# Altium project DRVS-MOTOR.PrjPcb
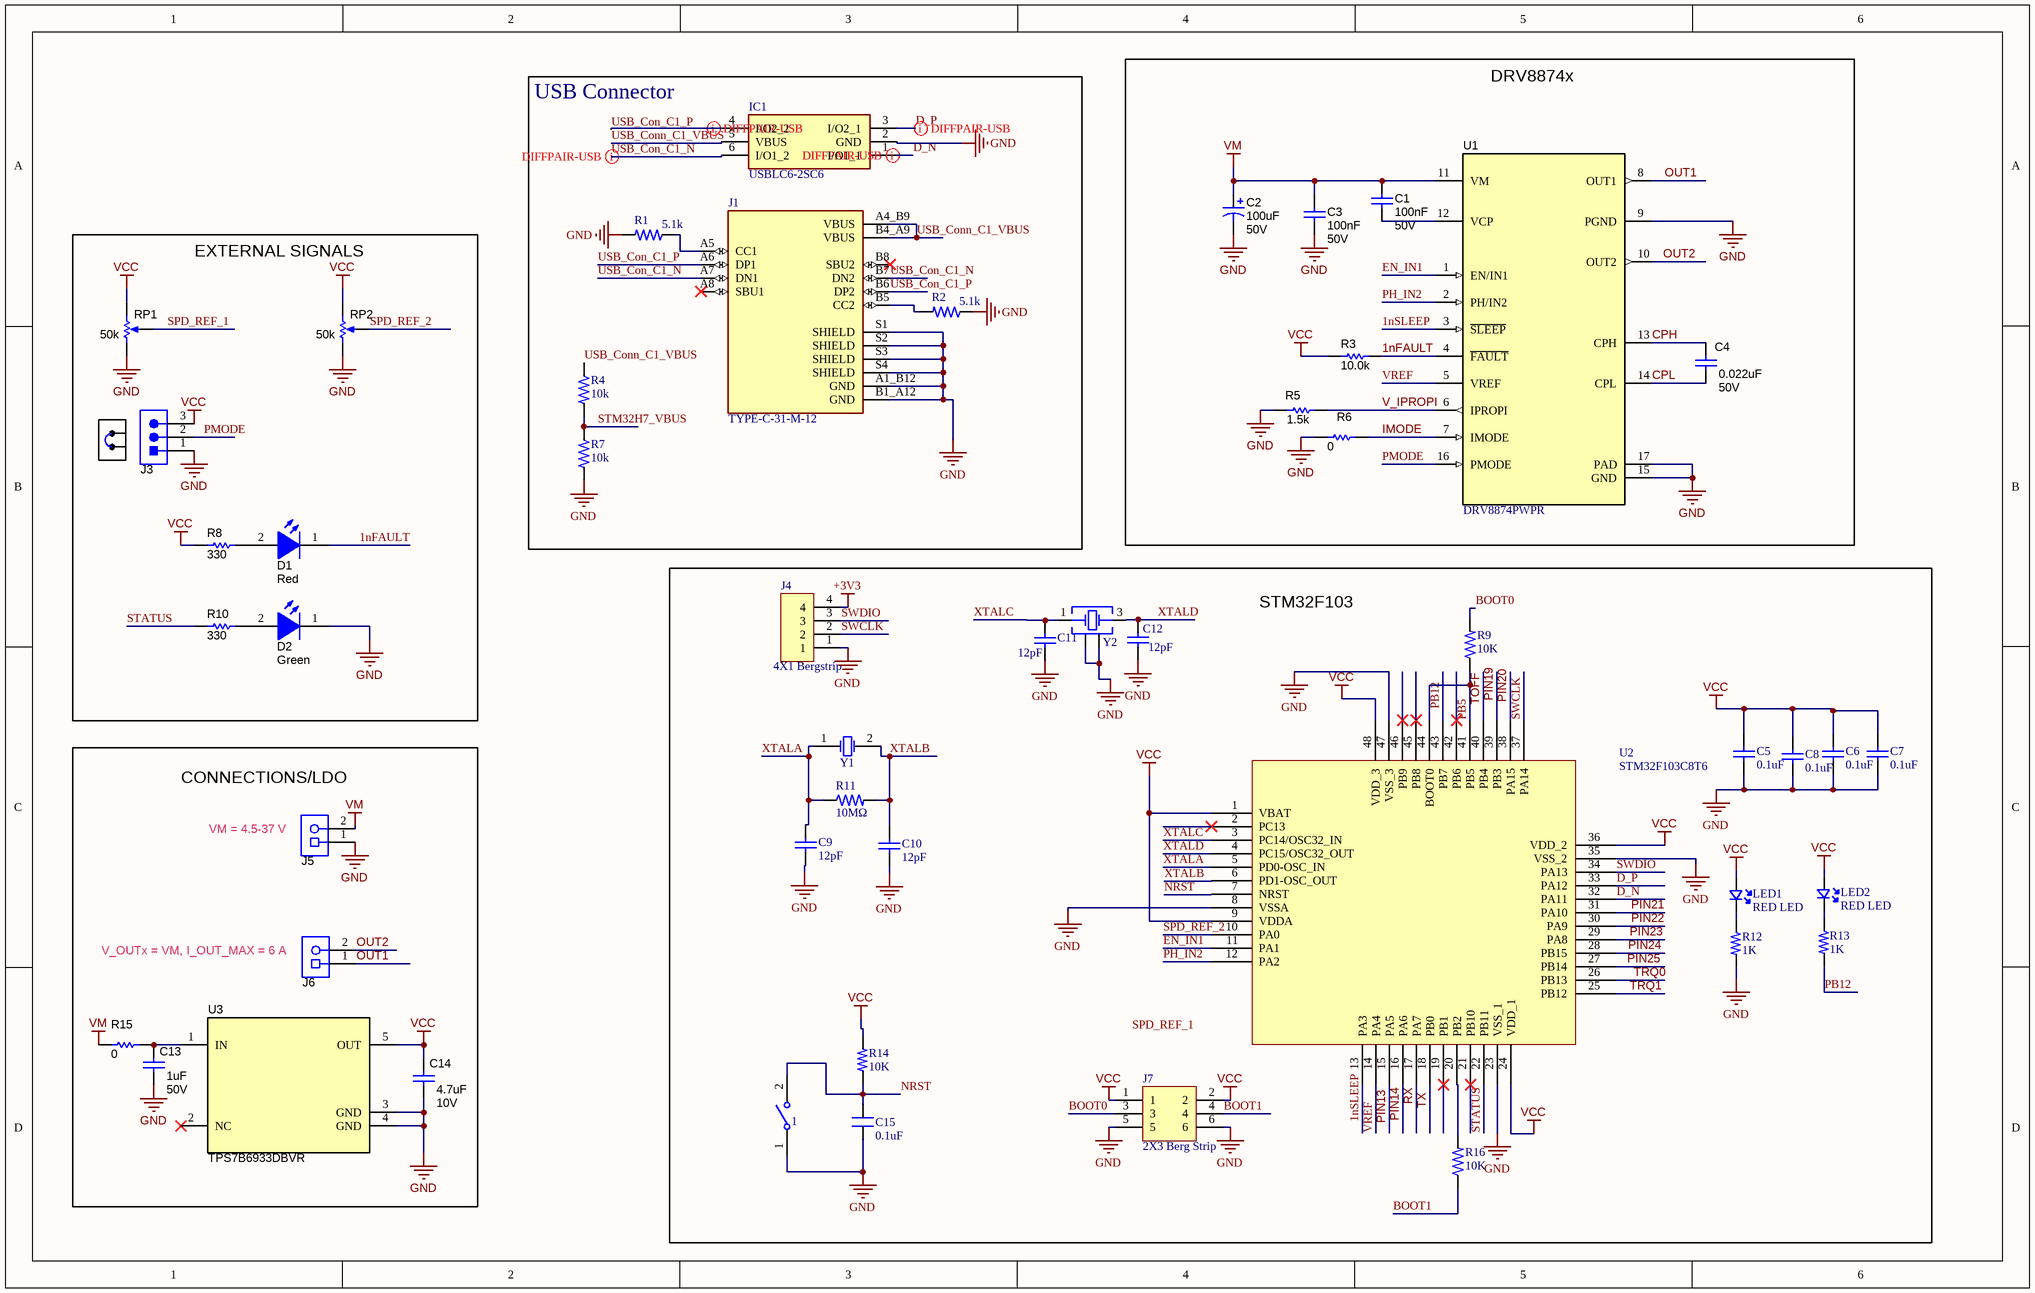
[diagram p0: DRVS-SCHEMA.SchDoc]
3 sheets, 72 parts. Net scope: global (net labels, ports and power ports of the same name join across sheets).
Board file: DRVS-PCB.PcbDoc
Sheets:
  DRVS-SCHEMA.SchDoc
  usb sheet.SchDoc
  stepper-schematic.SchDoc

## Sheet DRVS-SCHEMA.SchDoc
size 381 x 241 mm; SheetNumber: 1; SheetTotal: 3

### Parts
1  434113025826  [WS-TASV_L6W3.8H2.5_4341x30258x6]  (value not drawn)
C1  Cap_F: 100nF  VDC_V: 50V  [0603L]  (hidden comment: 885012206095)
C2  ValueDisplayed: 100uF  VDC_V: 50V  [BT_1000x1250]  (hidden comment: UBT1H101MPD1TD)
C3  Cap_F: 100nF  VDC_V: 50V  [0603L]  (hidden comment: 885012206095)
C4  ValueDisplayed: 0.022uF  VDC_V: 50V  [0603L]  (hidden comment: 885012206091)
C5  0.1uF  [WCAP-CSST_0603_L1.6W0.8H0.8_Reflow]
C6  0.1uF  [WCAP-CSST_0603_L1.6W0.8H0.8_Reflow]
C7  0.1uF  [WCAP-CSST_0603_L1.6W0.8H0.8_Reflow]
C8  0.1uF  [WCAP-CSST_0603_L1.6W0.8H0.8_Reflow]
C9  12pF  [WCAP-CSST_0603_L1.6W0.8H0.8_Reflow]
C10  12pF  [WCAP-CSST_0603_L1.6W0.8H0.8_Reflow]
C11  12pF  [WCAP-CSST_0603_L1.6W0.8H0.8_Reflow]
C12  12pF  [WCAP-CSST_0603_L1.6W0.8H0.8_Reflow]
C13  ValueDisplayed: 1uF  VDC_V: 50V  [0805L]  (hidden comment: 885012207103)
C14  ValueDisplayed: 4.7uF  VDC_V: 10V  [0603L]  (hidden comment: C0603C475K8PACTU)
C15  0.1uF  [CAP_0805]
D1  value Red  [WL-SMCW_RED]  (hidden comment: 150060RS75000)
D2  value Green  [WL-SMCW_GREEN]  (hidden comment: 150060VS75000)
IC1  USBLC6-2SC6  [SOT95P280X145-6N]
J1  TYPE-C-31-M-12  [HRO_TYPE-C-31-M-12]
J3  61300311121  [WURTH_61300311121]  (value not drawn)
J4  4X1 Bergstrip  [CON4_100_40D72_TH_ST_MALE]
J5  CMP-0054828-1  [Wurth_691101710002]  (value not drawn)
J6  CMP-0054828-1  [Wurth_691101710002]  (value not drawn)
J7  2X3 Berg Strip  [CON6_100_59D78_TH_ST_Duplicate]
LED1  RED LED  [LED_0805]
LED2  RED LED  [LED_0805]
R1  5.1k  [RESC2012X65N]
R2  5.1k  [RESC2012X65N]
R3  ValueDisplayed: 10.0k  [0603L]  (hidden comment: ERA-3ARW103V)
R4  10k  [RESC2012X65N]
R5  ValueDisplayed: 1.5k  [0603L]  (hidden comment: CRCW06031K50JNEA)
R6  ValueDisplayed: 0  [0603L]  (hidden comment: ERJ-3GEY0R00V)
R7  10k  [RESC2012X65N]
R8  ValueDisplayed: 330  [0603L]  (hidden comment: CRCW0603330RJNEA)
R9  10K  [RESC2012X65N]
R10  ValueDisplayed: 330  [0603L]  (hidden comment: CRCW0603330RJNEA)
R11  10MΩ  [RESC2012X65N]
R12  1K  [RES_0805]
R13  1K  [RES_0805]
R14  10K  [RES_0805]
R15  ValueDisplayed: 0  [0603L]  (hidden comment: ERJ-3GEY0R00V)
R16  10K  [RESC2012X65N]
RP1  value 50k  [Bourns_3352T]  (hidden comment: 3352T-1-503LF)
RP2  value 50k  [Bourns_3352T]  (hidden comment: 3352T-1-503LF)
SH-J1  60900213421  [Wurth_60900213421]  (value not drawn)
U1  DRV8874PWPR  [PWP0016J_N]
U2  STM32F103C8T6  [LQFP-48_19.6_393_58X11_SMD]
U3  TPS7B6933DBVR  [DBV0005A_N]
Y1  32.768kHz  [WE-XTAL_IQXC-25]  (value not drawn)
Y2  25MHz  [WE-XTAL_CFPX-180]  (value not drawn)

### Blocks framed on the sheet
DRV8874x: C1-C4 R3 R5 R6 U1
USB Connector: IC1 J1 R1 R2 R4 R7
EXTERNAL SIGNALS: D1 D2 J3 R8 R10 RP1 RP2 SH-J1
STM32F103: 1 C5-C12 C15 J4 J7 LED1 LED2 R9 R11-R14 R16 U2 Y1 Y2
CONNECTIONS/LDO: C13 C14 J5 J6 R15 U3

### Nets
+3V3: J4.4
GND: 1.1 C2.2(-) C3.2 C5.1 C6.1 C7.1 C8.1 C9.1 C10.1 C11.1 C12.1 C13.2 C14.2 C15.1 D2.1(K) IC1.2(GND) J1.A1_B12(GND) J1.B1_A12(GND) J1.S1(SHIELD) J1.S2(SHIELD) J1.S3(SHIELD) J1.S4(SHIELD) J3.1 J4.1 J5.1 J7.5 J7.6 R1.2 R2.1 R5.1 R6.1 R7.2 R12.1 RP1.1(CCW) RP2.1(CCW) U1.9(PGND) U1.15(GND) U1.17(PAD) U2.8(VSSA) U2.23(VSS_1) U2.35(VSS_2) U2.47(VSS_3) U3.3(GND) U3.4(GND) Y2.2(GND&Lid) Y2.4(GND&Lid)
VCC: C5.2 C6.2 C7.2 C8.2 C14.1 J3.3 J7.1 J7.2 LED1.A LED2.A R3.1 R8.1 R14.2 RP1.3(CW) RP2.3(CW) U2.1(VBAT) U2.9(VDDA) U2.24(VDD_1) U2.36(VDD_2) U2.48(VDD_3) U3.5(OUT)
VM: C1.1 C2.1(+) C3.1 J5.2 R15.1 U1.11(VM)
1nFAULT: D1.1(K) R3.2 U1.4(~{FAULT})
1nSLEEP: U1.3(~{SLEEP}) U2.13(PA3)
BOOT0: J7.3 R9.2
BOOT1: J7.4 R16.1
CPH: C4.1 U1.13(CPH)
CPL: C4.2 U1.14(CPL)
D_N: IC1.1(I/O1_1) U2.32(PA11)
D_P: IC1.3(I/O2_1) U2.33(PA12)
EN_IN1: U1.1(EN/IN1) U2.11(PA1)
IMODE: R6.2 U1.7(IMODE)
NRST: 1.2 C15.2 R14.1 U2.7(NRST)
OUT1: J6.1 U1.8(OUT1)
OUT2: J6.2 U1.10(OUT2)
PB5: R9.1 U2.41(PB5) U2.44(BOOT0)
PB12: R13.1 U2.43(PB7)
PH_IN2: U1.2(PH/IN2) U2.12(PA2)
PIN13: U2.15(PA5)
PIN14: U2.16(PA6)
PIN19: U2.39(PB3)
PIN20: U2.38(PA15)
PIN21: U2.31(PA10)
PIN22: U2.30(PA9)
PIN23: U2.29(PA8)
PIN24: U2.28(PB15)
PIN25: U2.27(PB14)
PMODE: J3.2 U1.16(PMODE)
RX: U2.17(PA7)
SPD_REF_1: RP1.2(WIPER)
SPD_REF_2: RP2.2(WIPER) U2.10(PA0)
STATUS: R10.1 U2.22(PB11)
STM32H7_VBUS: R4.2 R7.1
SWCLK: J4.2 U2.37(PA14)
SWDIO: J4.3 U2.34(PA13)
TOFF: U2.40(PB4)
TRQ0: U2.26(PB13)
TRQ1: U2.25(PB12)
TX: U2.18(PB0)
USB_Con_C1_N: IC1.6(I/O1_2) J1.A7(DN1) J1.B7(DN2)
USB_Con_C1_P: IC1.4(I/O2_2) J1.A6(DP1) J1.B6(DP2)
USB_Conn_C1_VBUS: IC1.5(VBUS) J1.A4_B9(VBUS) J1.B4_A9(VBUS) R4.1
V_IPROPI: R5.2 U1.6(IPROPI)
VREF: U1.5(VREF) U2.14(PA4)
XTALA: C9.2 R11.1 U2.5(PD0-OSC_IN) Y1.1(OSC1)
XTALB: C10.2 R11.2 U2.6(PD1-OSC_OUT) Y1.2(OSC2)
XTALC: C11.2 U2.3(PC14/OSC32_IN) Y2.1(Crystal)
XTALD: C12.2 U2.4(PC15/OSC32_OUT) Y2.3(Crystal)
NetC1_2: C1.2 U1.12(VCP)
NetC13_1: C13.1 R15.2 U3.1(IN)
NetD1_2: D1.2(A) R8.2
NetD2_2: D2.2(A) R10.2
NetJ1_A5: J1.A5(CC1) R1.1
NetJ1_B5: J1.B5(CC2) R2.2
NetLED1_K: LED1.K R12.2
NetLED2_K: LED2.K R13.2
NetR16_2: R16.2 U2.20(PB2)

Not connected (* = marked no-connect by the designer): J1 A8(SBU1)* B8(SBU2)*; U2 2(PC13)* 19(PB1)* 21(PB10)* 42(PB6)* 45(PB8)* 46(PB9)*; U3 2(NC)*

### Layout directives
differential pair; differential pair class Diff-90-USB: D_N, D_P, USB_Con_C1_N, USB_Con_C1_P

### Notes on the sheet
- (near J5) VM = 4.5-37 V
- (near J6) V_OUTx = VM, I_OUT_MAX = 6 A
- Labels drawn without touching a wire or pin: SPD_REF_1

### Library data of the parts
1 = BUTTON: WS-TASV J-Bend SMT Tact Switch, L6 x W3.8 x H2.5mm, 260g, SPST-NO, 12V, 50mA; Manufacturer: Wurth Elektronik; Washable: No; Manufacturer Part Number: 434113025826; Category: Tact Switches; Match Code: WS-TASV; ComponentLink1Description: Website Link; ComponentLink1URL: https://www.we-online.com/redexpert/article/434113025826?ad; ComponentLink2Description: Datasheet Link; ComponentLink2URL: https://www.we-online.com/redexpert/spec/434113025826?ad; Mount: Surface Mount; Operating Temperature Max: 85°C; Operating Temperature Min: -40°C; Packaging: Tape and Reel; Length: 6mm; Width: 3.8mm; Height: 2.5mm; Circuit: SPST-NO; Contact Material: Stainless Steel; Contact Plating: Silver; Operation Force: 260g; Rated Current: 50mA; Rated Voltage (DC): 12V; Terminal Material: Copper Alloy; Terminal Plating: Silver
C1 C3 = CMP-0006837-4: CAP, CERM, 0.1 uF, 50 V, +/- 10%, X7R, 0603; Manufacturer: Wurth Elektronik; Polarized: N; CompType: Capacitor; Value: 0.1uF; U/M: EA; Value1: Unknown; TaMin_C: -55°C; TaMax_C: 125°C; Cap_Case: 0603; SizeArea_mm2: 1.28; SizeAreaWB_mm2: 4.68; SizeX_mm: 1.6; SizeY_mm: 0.8; SizeZ_mm: 1; AEC Category: Q200; PartNumber: 885012206095; ValueDisplayed: 0.1uF; PackageReference: 0603; RoHS: Y; Tolerance_%: 10%; Value2: 50V; MountType: SMT; Technology: Ceramic; TempCo: X7R; Published: 2008-06-19; Publisher: Texas Instruments; LatestRevisionDate: 2017-03-09; ComponentLink1Description: Datasheet link; ComponentLink1URL: http://katalog.we-online.de/pbs/datasheet/885012206095.pdf; AEC Qualified: N; AEC Grade: N/A
C2 = CMP-0009918-2: CAP, AL, 100 uF, 50 V, +/- 20%, TH; Manufacturer: Nichicon; Polarized: Y; CompType: Capacitor; Value: 100uF; U/M: EA; Cap_F: 100µF; Value1: Unknown; IRMS_A: 5.55dA; TaMin_C: -40°C; TaMax_C: 125°C; Cap_Case: 10x12.5mm; SizeAreaWB_mm2: 144; SizeArea_mm2: 100; SizeX_mm: 10; SizeZ_mm: 14.5; AEC Category: Q200; AEC Qualified: N; PartNumber: UBT1H101MPD1TD; PackageReference: Cap, 10x12.5mm; RoHS: Y; Tolerance_%: 20%; Value2: 50V; MountType: TH; Technology: AL; Series: BT; Publisher: Texas Instruments; LatestRevisionDate: 2017-03-09; ComponentLink1Description: Datasheet link; ComponentLink1URL: http://nichicon-us.com/english/products/pdfs/e-ubt.pdf; Supplier 1: Digi-Key; Supplier Part Number 1: 493-4508-1-ND; Supplier 2: Newark; Supplier Part Number 2: 26T5990; Supplier 3: Mouser; Supplier Part Number 3: 647-UBT1H101MPD1TD; SizeY_mm: 10; AEC Grade: N/A
C4 = CMP-0006836-4: CAP, CERM, 0.022 uF, 50 V, +/- 10%, X7R, 0603; Manufacturer: Wurth Elektronik; Polarized: N; CompType: Capacitor; U/M: EA; Cap_F: 22nF; Value1: Unknown; TaMin_C: -55°C; TaMax_C: 125°C; Cap_Case: 0603; SizeArea_mm2: 1.28; SizeAreaWB_mm2: 4.68; SizeX_mm: 1.6; SizeY_mm: 0.8; SizeZ_mm: 1; AEC Category: Q200; Value: 0.022uF; PartNumber: 885012206091; PackageReference: 0603; RoHS: Y; Tolerance_%: 10%; Value2: 50V; MountType: SMT; Technology: Ceramic; TempCo: X7R; Published: 2008-06-19; Publisher: Texas Instruments; LatestRevisionDate: 2017-03-09; ComponentLink1Description: Datasheet link; ComponentLink1URL: http://katalog.we-online.de/pbs/datasheet/885012206091.pdf; AEC Qualified: N; AEC Grade: N/A
C5-C8 = 0.1uF capacitor: WCAP-CSST Multilayer Ceramic Chip Capacitor, Soft Termination, size 0603, X7R Class II, 220pF, 50VDC; Manufacturer Part Number: 885382206001; Manufacturer: Wurth Elektronik; Case/Size Code: 0603; Capacitance Tolerance: +/-10%; Dissipation Factor: 2.5%; Insulation Resistance: 10GΩ; Rated Voltage (DC): 50V; Technical Reference: X7R0603221K050DFCT1S000; Category: Multilayer Ceramic Chip Capacitors; Match Code: WCAP-CSST; ComponentLink1Description: Website Link; ComponentLink1URL: https://www.we-online.com/redexpert/article/885382206001?ad; ComponentLink2Description: Datasheet Link; ComponentLink2URL: https://www.we-online.com/redexpert/spec/885382206001?ad; Mount: Surface Mount; Operating Temperature Max: 125°C; Operating Temperature Min: -55°C; Packaging: Tape and Reel; Length: 1.6mm; Width: 0.8mm; Height: 0.8mm; Capacitance: 220pF; Ceramic Type: X7R Class II
C9-C12 = 0.1uF capacitor_4: WCAP-CSST Multilayer Ceramic Chip Capacitor, Soft Termination, size 0603, X7R Class II, 220pF, 50VDC; Manufacturer Part Number: 885382206001; Manufacturer: Wurth Elektronik; Case/Size Code: 0603; Capacitance Tolerance: +/-10%; Dissipation Factor: 2.5%; Insulation Resistance: 10GΩ; Rated Voltage (DC): 50V; Technical Reference: X7R0603221K050DFCT1S000; Category: Multilayer Ceramic Chip Capacitors; Match Code: WCAP-CSST; ComponentLink1Description: Website Link; ComponentLink1URL: https://www.we-online.com/redexpert/article/885382206001?ad; ComponentLink2Description: Datasheet Link; ComponentLink2URL: https://www.we-online.com/redexpert/spec/885382206001?ad; Mount: Surface Mount; Operating Temperature Max: 125°C; Operating Temperature Min: -55°C; Packaging: Tape and Reel; Length: 1.6mm; Width: 0.8mm; Height: 0.8mm; Capacitance: 220pF; Ceramic Type: X7R Class II
C13 = CMP-0007696-2: CAP, CERM, 1 uF, 50 V, +/- 10%, X7R, 0805; Manufacturer: Wurth Elektronik; Polarized: N; CompType: Capacitor; Value: 1uF; U/M: EA; Cap_F: 1µF; Value1: Unknown; TaMin_C: -55°C; TaMax_C: 125°C; Cap_Case: 0805; SizeArea_mm2: 2.5; SizeAreaWB_mm2: 6.75; SizeX_mm: 2; SizeY_mm: 1.25; SizeZ_mm: 1.45; AEC Category: Q200; PartNumber: 885012207103; PackageReference: 0805; RoHS: Y; Tolerance_%: 10%; Value2: 50V; MountType: SMT; Technology: Ceramic; TempCo: X7R; Published: 2008-06-19; Publisher: Texas Instruments; LatestRevisionDate: 2017-03-09; ComponentLink1Description: Datasheet link; ComponentLink1URL: http://katalog.we-online.de/pbs/datasheet/885012207103.pdf; Supplier 1: Mouser; Supplier Part Number 1: 710-885012207103; AEC Qualified: N; AEC Grade: N/A
C14 = CMP-0006949-5: CAP, CERM, 4.7 uF, 10 V, +/- 10%, X5R, 0603; Manufacturer: Kemet; Polarized: N; CompType: Capacitor; Value: 4.7uF; U/M: EA; Cap_F: 4.7µF; ESR_ohm: 6m; Value1: 0.006 ohm; IRMS_A: 7.24A; TaMin_C: -55°C; TaMax_C: 85°C; Cap_Case: 0603; SizeArea_mm2: 1.28; SizeAreaWB_mm2: 4.68; SizeX_mm: 1.6; SizeY_mm: 0.8; SizeZ_mm: 1; AEC Category: Q200; PartNumber: C0603C475K8PACTU; PackageReference: 0603; RoHS: Y; Tolerance_%: 10%; Value2: 10V; MountType: SMT; Technology: Ceramic; TempCo: X5R; Published: 2008-06-19; Publisher: Texas Instruments; LatestRevisionDate: 2017-03-09; ComponentLink1Description: Datasheet link; ComponentLink1URL: http://www.kemet.com/kemet/web/homepage/kechome.nsf/vapubfiles/F3102_Y5V.pdf/$file/F3102_Y5V.pdf; Supplier 1: Digi-Key; Supplier Part Number 1: 399-5503-1-ND; Supplier 2: Mouser; Supplier Part Number 2: 80-C0603C475K8P; Supplier 3: Farnell; Supplier Part Number 3: 1572625; AEC Qualified: ?
C15 = CAP_0.1uF-50V-5%-0805: 0.1µF ±5% 50V Ceramic Capacitor X7R 0805 (2012 Metric); Manufacturer: KEMET; Manufacturing Part Number: C0805C104J5RACTU; Case/Package: 0805 (2012 Metric); Supplier-1: Digikey; Supplier Part Number-1: 399-1171-1-ND
D1 = CMP-0002947-2: LED, Red, SMD; Manufacturer: Wurth Elektronik; Type: AlInGaP; Vf_V: 2V; Io_A: 30mA; Vr_V: 5V; Tjmax_C: 85°C; Power_TotalModule: 72mW; Value1: 0.072W; Angle: 140; U/M: EA; CompType: LED; PartNumber: 150060RS75000; MountType: SMT; RoHS: Y; PackageReference: LED_0603; Value2: 2V; Color: Red; Published: 2008-07-11; Publisher: Texas Instruments; ComponentLink1URL: http://katalog.we-online.de/led/datasheet/150060RS75000.pdf; ComponentLink1Description: Datasheet link; LatestRevisionDate: 2017-03-09; Supplier 1: Digi-Key; Supplier Part Number 1: 732-4978-1-ND; Supplier 2: Newark; Supplier Part Number 2: 95W3795; Supplier 3: Mouser; Supplier Part Number 3: 710-150060RS75000
D2 = CMP-0002894-1: LED, Green, SMD; Manufacturer: Wurth Elektronik; Type: AlInGaP; Vf_V: 2V; Io_A: 20mA; Value1: W; U/M: EA; CompType: LED; PartNumber: 150060VS75000; MountType: SMT; RoHS: Y; PackageReference: LED_0603; Value2: 2V; Color: green; Published: 2008-07-11; Publisher: Texas Instruments; ComponentLink1URL: http://katalog.we-online.de/led/datasheet/150060VS75000.pdf; ComponentLink1Description: Datasheet link; LatestRevisionDate: 2017-03-09; Supplier 1: Digi-Key; Supplier Part Number 1: 732-4980-1-ND; Supplier 2: Newark; Supplier Part Number 2: 95W3797; Supplier 3: Farnell; Supplier Part Number 3: 2322073
IC1 = USBLC6-2SC6: Integrated Circuit; Manufacturer_Name: STMicroelectronics; Datasheet Link: http://www.st.com/st-web-ui/static/active/en/resource/technical/document/datasheet/CD00050750.pdf; Height: 1.45mm; Manufacturer_Part_Number: USBLC6-2SC6; Mouser Part Number: 511-USBLC6-2SC6; Mouser Price/Stock: https://www.mouser.co.uk/ProductDetail/STMicroelectronics/USBLC6-2SC6?qs=po45yt2pPpu%2FhNIlwQdTlg%3D%3D; Arrow Part Number: USBLC6-2SC6; Arrow Price/Stock: https://www.arrow.com/en/products/usblc6-2sc6/stmicroelectronics?region=europe
J1 = TYPE-C-31-M-12: USB Connectors 24 Receptacle 1 8.94*7.3mm RoHS; MF: HRO Electronics Co., Ltd.; Price: None; Value: *; SnapEDA_Link: https://www.snapeda.com/parts/TYPE-C-31-M-12/HRO+Electronics+Co.%252C+Ltd./view-part/?ref=snap; Package: Package; Availability: Not in stock; Check_prices: https://www.snapeda.com/parts/TYPE-C-31-M-12/HRO+Electronics+Co.%252C+Ltd./view-part/?ref=eda; MP: TYPE-C-31-M-12
J3 = CMP-0054796-1: Header, 2.54 mm, 3x1, Gold, TH; Manufacturer: Wurth Elektronik; Green_Lifecycle: Active; Green_REACh: Passed; CNHeader: TRUE; CT: FALSE; PartNumber: 61300311121; PackageReference: Header, 2.54mm, 3x1, TH; ClassName: Header; CompType: Header; RoHS: Y; MountType: TH; ComponentLink1Description: Datasheet URL; ComponentLink1URL: http://katalog.we-online.de/em/datasheet/6130xx11121.pdf; Publisher: Texas Instruments; LatestRevisionDate: 26/05/2017; Supplier 1: Digi-Key; Supplier Part Number 1: 732-5316-ND; Supplier 2: Newark; Supplier Part Number 2: 20X0950; Supplier 3: Farnell; Supplier Part Number 3: 356154; Green_EU RoHS: Passed; Green_EU RoHS-2: Incomplete
J4 = CON-BS-PLG_4X1-100-TH-ST: 4 pin, 1 row, 2.54mm pitch bergstrip; Manufacturer: NA; Manufacturing Part Number: NA; Case/Package: TH; Supplier-1: NA; Supplier Part Number-1: NA
J5 J6 = CMP-0054828-1: Terminal Block, 5 mm, 2x1, Tin, TH; PartNumber: 691 101 710 002; Manufacturer: Wurth Elektronik; CNHeader: FALSE; Green_Lifecycle: Active; Green_REACh: Passed; CT: TRUE; PackageReference: Terminal Block, 5 mm, 2x1, TH; CompType: Terminal Block; RoHS: Y; MountType: TH; ComponentLink1Description: Datasheet URL; ComponentLink1URL: http://katalog.we-online.de/em/datasheet/6911017100xx.pdf; Publisher: Texas Instruments; LatestRevisionDate: 26/05/2017; Supplier 1: Digi-Key; Supplier Part Number 1: 732-2026-ND; Supplier 2: Mouser; Supplier Part Number 2: 710-691101710002; Green_EU RoHS-2: Incomplete; Green_EU RoHS: Passed
J7 = CON-BS-PLG_2X3-100-TH-ST: 6 pin, 2 row, 2.54mm pitch bergstrip; Manufacturer: NA; Manufacturer Part Number: NA; Case/Package: TH; Supplier-1: NA; Supplier Part Number-1: NA
LED1 LED2 = LED-RED_10mA-0805: Red 621nm LED Indication - Discrete 2V 0805 (2012 Metric); Manufacturer: Lite-On Inc.; Manufacturer Part Number: LTST-C170EKT; Case/ Package: 0805; Supplier-1: Digikey; Supplier Part Number-1: 160-1178-1-ND
R1 R2 R4 R7 = resisitor: Fixed Resistors; MP: CRG0805F33R; MF: TE Connectivity; Price: None; Package: 0805; Value: *; Purchase-URL: https://pricing.snapeda.com/search/part/CRG0805F33R/?ref=eda; Check_prices: https://www.snapeda.com/parts/CRG0805F33R/TE+Connectivity+Passive+Product/view-part/?ref=eda; Availability: In Stock; EU_RoHS_Compliance: Compliant with Exemptions; SnapEDA_Link: https://www.snapeda.com/parts/CRG0805F33R/TE+Connectivity+Passive+Product/view-part/?ref=snap
R3 = RES-10K-0603: RES, 10.0 k, 0.05%, 0.1 W, AEC-Q200 Grade 0, 0603; Manufacturer: Panasonic; Res_ohm: 10k; CompType: Resistor; Value: 10.0k; SizeY_mm: 0.8; SizeArea_mm2: 1.28; SizeAreaWB_mm2: 4.68; AEC Grade: 0; Power_W: 100mW; SizeX_mm: 1.6; Value2: 0.1W; Value_Code: 10k0; SizeZ_mm: 1; AEC Qualified: Y; AEC Category: Q200; TempCo: 10 ppm/C; ComponentLink1URL: https://industrial.panasonic.com/cdbs/www-data/pdf/RDM0000/AOA0000C307.pdf; Value1: 0.05%; RoHS: Y; MountType: SMT; PartNumber: ERA-3ARW103V; PackageReference: 0603; ComponentLink1Description: Datasheet link; Tolerance_%: 0.05%; Technology: Thin Film
R5 = CMP-0025733-4: RES, 1.5 k, 5%, 0.1 W, AEC-Q200 Grade 0, 0603; Manufacturer: Vishay-Dale; CompType: Resistor; Value: 1.5k; Value_Code: 1k50; Power_W: 100mW; Value2: 0.1W; VDC_V: 75V; TempCo: 200 ppm/C; SizeArea_mm2: 1.28; SizeX_mm: 1.6; SizeY_mm: 0.8; SizeZ_mm: 1; EIA_Code: E24; AEC Category: Q200; AEC Qualified: Y; AEC Grade: 0; PartNumber: CRCW06031K50JNEA; PackageReference: 0603; RoHS: E; Res_ohm: 1.5k; Tolerance_%: 5%; Value1: 5%; MountType: SMT; Technology: Thick Film; ComponentLink1Description: Datasheet link; ComponentLink1URL: http://www.vishay.com/docs/20035/dcrcwe3.pdf; Supplier 1: Digi-Key; Supplier Part Number 1: 541-1.5KGCT-ND; Supplier 2: Newark; Supplier Part Number 2: 59M6753; Supplier 3: Mouser; Supplier Part Number 3: 71-CRCW0603J-1.5K-E3
R6 R15 = CMP-0025874-3: RES, 0, 5%, 0.1 W, 0603; Manufacturer: Panasonic; CompType: Resistor; Value: 0; Value_Code: 0000; Power_W: 100mW; Value2: 0.1W; VDC_V: 50V; TempCo: 600 ppm/C; EIA_Code: E24; U/M: EA; SizeArea_mm2: 1.28; SizeX_mm: 1.6; SizeY_mm: 0.8; SizeZ_mm: 1; AEC Category: Q200; PartNumber: ERJ-3GEY0R00V; PackageReference: 0603; RoHS: Y; Res_ohm: 0; Tolerance_%: 5%; Value1: 5%; MountType: SMT; Technology: Thick Film; Published: 2008-06-26; Publisher: Texas Instruments; LatestRevisionDate: 2017-03-09; ComponentLink1Description: Datasheet link; ComponentLink1URL: http://www.panasonic.com/industrial/components/pdf/AOA0000CE1.pdf; Supplier 1: Digi-Key; Supplier Part Number 1: P0.0GCT-ND; Supplier 2: Mouser; Supplier Part Number 2: 667-ERJ-3GEY0R00V; Supplier 3: Farnell; Supplier Part Number 3: 2059527; AEC Qualified: ?
R8 R10 = CMP-0025785-4: RES, 330, 5%, 0.1 W, AEC-Q200 Grade 0, 0603; Manufacturer: Vishay-Dale; CompType: Resistor; Value: 330; Value_Code: 330R; Power_W: 100mW; Value2: 0.1W; VDC_V: 75V; TempCo: 200 ppm/C; EIA_Code: E24; AEC Category: Q200; AEC Grade: 0; AEC Qualified: Y; SizeArea_mm2: 1.28; SizeX_mm: 1.6; SizeY_mm: 0.8; SizeZ_mm: 1; PartNumber: CRCW0603330RJNEA; PackageReference: 0603; RoHS: E; Res_ohm: 330; Tolerance_%: 5%; Value1: 5%; MountType: SMT; Technology: Thick Film; ComponentLink1Description: Datasheet link; ComponentLink1URL: http://www.vishay.com/docs/20035/dcrcwe3.pdf; Supplier 1: Digi-Key; Supplier Part Number 1: 541-330GCT-ND; Supplier 2: Newark; Supplier Part Number 2: 59M6805; Supplier 3: Mouser; Supplier Part Number 3: 71-CRCW0603J-330-E3
R9 R11 R16 = resisitor_3: Fixed Resistors; MP: CRG0805F33R; MF: TE Connectivity; Price: None; Package: 0805; Value: *; Purchase-URL: https://pricing.snapeda.com/search/part/CRG0805F33R/?ref=eda; Check_prices: https://www.snapeda.com/parts/CRG0805F33R/TE+Connectivity+Passive+Product/view-part/?ref=eda; Availability: In Stock; EU_RoHS_Compliance: Compliant with Exemptions; SnapEDA_Link: https://www.snapeda.com/parts/CRG0805F33R/TE+Connectivity+Passive+Product/view-part/?ref=snap
R12 R13 = RES_1K-0.125W-1%-0805: 1 kOhms ±1% 0.125W, 1/8W Chip Resistor 0805 (2012 Metric) Moisture Resistant Thick Film; Manufacturer: 垈㎵á; Manufacturer Part Number: RC0805FR-071KL; Case/Package: 0805; Supplier-1: Digikey; Supplier Part Number-1: 311-1.00KCRCT-ND
R14 = RES_10K-0.125W-1%-0805: 10 kOhms ±1% 0.125W, 1/8W Chip Resistor 0805 (2012 Metric) Moisture Resistant Thick Film; Manufacturer: Yageo; Manufacturing Part Number: RC0805FR-0710KL; Case/Package: 0805; Supplier-1: Digikey; Supplier Part Number-1: 311-10.0KCRCT-ND
RP1 RP2 = CMP-0001777-2: Trimming Potentiometer, 50K, 0.5W, TH; Manufacturer: Bourns; CompType: Trimmer; ComponentLink1URL: http://www.bourns.com/data/global/PDFs/3352.pdf; PackageReference: 9.53x8.89mm; PartNumber: 3352T-1-503LF; ComponentLink1Description: Datasheet URL; Supplier 1: Digi-Key; Supplier Part Number 1: 3352T-503LF-ND; MountType: TH; RoHS: Y; Publisher: Texas Instruments; LatestRevisionDate: 09/03/2017; Supplier 2: Newark; Supplier Part Number 2: 32K8175; Supplier 3: Mouser; Supplier Part Number 3: 652-3352T-1-503LF
SH-J1 = CMP-0003761-1: Shunt, 2.54mm, Gold, Black; Manufacturer: Wurth Elektronik; CompType: Shunt; PartNumber: 60900213421; RoHS: Y; PackageReference: Shunt, 2.54mm, Black; MountType: N/A; ComponentLink1Description: Datasheet Link; ComponentLink1URL: http://katalog.we-online.de/em/datasheet/60900213421.pdf; Publisher: Texas Instruments; LatestRevisionDate: 2017-03-09; Supplier 1: Digi-Key; Supplier Part Number 1: 732-2678-ND; Supplier 2: Newark; Supplier Part Number 2: 16T0609; Supplier 3: Mouser; Supplier Part Number 3: 710-60900213421; Key: 60900213421
U1 = CMP-0081845-1: H-Bridge Motor Drivers With Integrated Current Sense and Regulation, PWP0016J (HTSSOP-16); Alternate Manufacturer: Texas Instruments; SizeAreaWB_mm2: 58.8; SizeZ_mm: 1.2; SizeX_mm: 6.4; SizeY_mm: 5; SizeArea_mm2: 32; CompType: IC; AEC Qualified: N; AEC Category: Q200; ComponentLink1URL: http://www.ti.com/lit/ds/symlink/drv8874.pdf; Alternate PartNumber: DRV8874PWP; PackageDescription: HTSSOP-16; MountType: SMT; ComponentLink2URL: http://www.ti.com/product/drv8874; ComponentLink3Description: Online Datasheet; ComponentLink2Description: Product Folder; Manufacturer: Texas Instruments; ComponentLink3URL: http://www.ti.com/product/drv8874/datasheet; PackageReference: PWP0016J; ComponentLink1Description: Datasheet Link; PartNumber: DRV8874PWPR
U2 = IC-STM32F103C8T6 _1: ARM® Cortex®-M3 STM32F1 Microcontroller IC 32-Bit 72MHz 64KB (64K x 8) FLASH; Manufacturer: STMicroelectronics; Manufacturer Part Number: STM32F103C8T6; Case/Package: 48-LQFP; Supplier-1: Digikey; Supplier Part Number-1: 497-6063-ND
U3 = CMP-0077328-2: 40-V Ultralow-Iq Low-Dropout Regulator, DBV0005A (SOT-23-5); Manufacturer: Texas Instruments; SizeArea_mm2: 8.12; CompType: IC; SizeAreaWB_mm2: 14.82; SizeY_mm: 2.9; SizeZ_mm: 1.45; SizeX_mm: 2.8; AEC Category: Q200; AEC Qualified: N; PackageDescription: SOT-23-5; PackageReference: DBV0005A; ComponentLink1Description: Datasheet Link; MountType: SMT; ComponentLink1URL: http://www.ti.com/lit/ds/symlink/tps7b69.pdf; Alternate Manufacturer: Texas Instruments; RoHS: Y; ComponentLink2Description: Product Folder; ComponentLink2URL: http://www.ti.com/product/tps7b69; ComponentLink3Description: Online Datasheet; ComponentLink3URL: http://www.ti.com/product/tps7b69/datasheet; PartNumber: TPS7B6933DBVR
Y1 = CRYSTAL 32.768kH: WE-XTAL Watch Crystal, SMT, IQXC-25, 32.768kHz, +/-10ppm; Manufacturer Part Number: 830062558; Manufacturer: Wurth Elektronik; Load Capacitance: 9pF; ComponentLink1Description: Website Link; ComponentLink1URL: https://www.we-online.com/redexpert/article/830062558?ad; ComponentLink2Description: Datasheet Link; ComponentLink2URL: https://www.we-online.com/redexpert/spec/830062558?ad; Category: Crystals; Match Code: WE-XTAL; Mount: Surface Mount; Operating Temperature Max: 85°C; Operating Temperature Min: -40°C; Packaging: Tape and Reel; Case/Size Code: IQXC-25; Length: 2mm; Width: 1.2mm; Height: 0.6mm; Frequency: 32.768kHz; Frequency Tolerance: +/-10ppm
Y2 = Crystals: WE-XTAL Quartz Crystal, SMT, CFPX-180, 25MHz, +/-10ppm; Manufacturer Part Number: 830108174209; Manufacturer: Wurth Elektronik; Frequency Stability: +/-15ppm; Load Capacitance: 10pF; ComponentLink1Description: Website Link; ComponentLink1URL: https://www.we-online.com/redexpert/article/830108174209?ad; ComponentLink2Description: Datasheet Link; ComponentLink2URL: https://www.we-online.com/redexpert/spec/830108174209?ad; Category: Crystals; Match Code: WE-XTAL; Mount: Surface Mount; Operating Temperature Max: 85°C; Operating Temperature Min: -40°C; Packaging: Tape and Reel; Case/Size Code: CFPX-180; Length: 3.4mm; Width: 2.7mm; Height: 0.8mm; Frequency: 25MHz; Frequency Tolerance: +/-10ppm

## Sheet usb sheet.SchDoc
size A; SheetNumber: 2; SheetTotal: 3
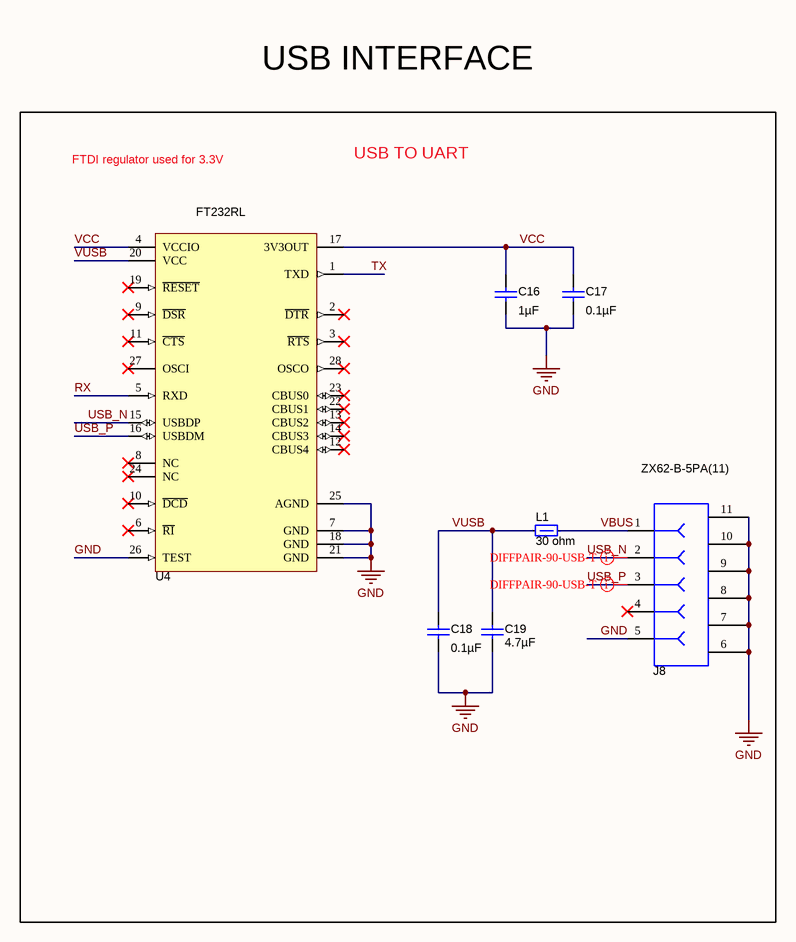
[diagram p1: usb sheet.SchDoc]

### Parts
C16  ValueDisplayed: 1µF  [0402L]  (hidden comment: GRM155R61A105KE15D)
C17  ValueDisplayed: 0.1µF  [0402L]  (hidden comment: GRM155R61A104KA01D)
C18  ValueDisplayed: 0.1µF  [0402L]  (hidden comment: GRM155R61A104KA01D)
C19  ValueDisplayed: 4.7µF  [0603L]  (hidden comment: CGB3B1X5R1A475K055AC)
J8  ZX62-B-5PA(11)  [CONN_USB_micro_ZX62-B-5PA]
L1  value 30 ohm  [0805L]  (hidden comment: MMZ2012R300A)
U4  FT232RL  [SSOP28_M]

### Nets
GND: C16.2 C17.2 C18.2 C19.2 J8.5 J8.6 J8.7 J8.8 J8.9 J8.10 J8.11 U4.7(GND) U4.18(GND) U4.21(GND) U4.25(AGND) U4.26(TEST)
VCC: C16.1 C17.1 U4.4(VCCIO) U4.17(3V3OUT)
RX: U4.5(RXD)
TX: U4.1(TXD)
USB_N: J8.2 U4.15(USBDP)
USB_P: J8.3 U4.16(USBDM)
VBUS: J8.1 L1.2
VUSB: C18.1 C19.1 L1.1 U4.20(VCC)

Not connected (* = marked no-connect by the designer): J8 4*; U4 2(~{DTR})* 3(~{RTS})* 6(~{RI})* 8(NC)* 9(~{DSR})* 10(~{DCD})* 11(~{CTS})* 12(CBUS4)* 13(CBUS2)* 14(CBUS3)* 19(~{RESET})* 22(CBUS1)* 23(CBUS0)* 24(NC)* 27(OSCI)* 28(OSCO)*

### Layout directives
differential pair; differential pair class DIFFPAIR-90-USB: USB_N, USB_P

### Notes on the sheet
- USB INTERFACE
- USB TO UART
- FTDI regulator used for 3.3V

### Library data of the parts
C16 = GRM155R61A105KE15D: CAP, CERM, 1 µF, 10 V, +/- 10%, X5R, 0402; Manufacturer: MuRata; Value: 1uF; Polarized: N; CompType: Capacitor; U/M: EA; Cap_F: 0.000001; Tolerance_%: 10; Value1: Unknown; Value2: 10V; TaMin_C: -55; TaMax_C: 85; Cap_Case: 0402; SymbolVersion: 2008-07-09; PartNumber: GRM155R61A105KE15D; PackageReference: 0402; RoHS: Y; VDC_V: 10; MountType: SMT; Technology: Ceramic; TempCo: X5R; Published: 2008-06-19; Publisher: Texas Instruments; LatestRevisionDate: 2015-06-10; ComponentLink1Description: Datasheet link; ComponentLink1URL: http://search.murata.co.jp/Ceramy/PnsearchViewAction.do?HnOFG=ON&HnNFG=ON&SEL_CNT=50&sLang=en&sKey=GRM155R61A105KE15D&x=9&y=9&search=startwith; Supplier 1: Digi-Key; Supplier Part Number 1: 490-3890-1-ND; Supplier 2: Mouser; Supplier Part Number 2: 81-GRM155R61A105KE15; Supplier 3: Farnell; Supplier Part Number 3: 1735523
C17 C18 = GRM155R61A104KA01D: CAP, CERM, 0.1 µF, 10 V, +/- 10%, X5R, 0402; Manufacturer: MuRata; Value: 0.1uF; Polarized: N; CompType: Capacitor; U/M: EA; Cap_F: 0.0000001; Tolerance_%: 10; Value1: Unknown; Value2: 10V; TaMin_C: -55; TaMax_C: 85; Cap_Case: 0402; SymbolVersion: 2008-07-09; PartNumber: GRM155R61A104KA01D; PackageReference: 0402; RoHS: Y; VDC_V: 10; MountType: SMT; Technology: Ceramic; TempCo: X5R; Published: 2008-06-19; Publisher: Texas Instruments; LatestRevisionDate: 2015-06-10; ComponentLink1Description: Datasheet link; ComponentLink1URL: http://search.murata.co.jp/Ceramy/PnsearchViewAction.do?HnOFG=ON&HnNFG=ON&SEL_CNT=50&sLang=en&sKey=GRM155R61A104KA01D&x=9&y=9&search=startwith; Supplier 1: Digi-Key; Supplier Part Number 1: 490-1318-1-ND; Supplier 2: Mouser; Supplier Part Number 2: 81-GRM155R61A104KA01; Supplier 3: Farnell; Supplier Part Number 3: 1828862
C19 = CGB3B1X5R1A475K055AC: CAP, CERM, 4.7 µF, 10 V, +/- 10%, X5R, 0603; Manufacturer: TDK; Polarized: N; CompType: Capacitor; Value: 4.7uF; U/M: EA; Cap_F: 0.0000047; Tolerance_%: 10; Value1: Unknown; Value2: 10V; TaMin_C: -55; TaMax_C: 85; Cap_Case: 0603; SymbolVersion: 2008-07-09; PartNumber: CGB3B1X5R1A475K055AC; PackageReference: 0603; RoHS: Y; VDC_V: 10; MountType: SMT; Technology: Ceramic; TempCo: X5R; Published: 2008-06-19; Publisher: Texas Instruments; LatestRevisionDate: 2015-06-10; ComponentLink1Description: Datasheet link; ComponentLink1URL: http://www.tdk.com/pdf/mlcc_product_guide_A12.pdf; Supplier 1: Digi-Key; Supplier Part Number 1: 445-7482-1-ND
J8 = ZX62-B-5PA(11): Connector, Receptacle, Micro-USB Type B, R/A, Bottom Mount SMT; Manufacturer: Hirose Electric Co. Ltd.; SymbolCreator: a0411947; U/M: EA; SymbolVersion: 2013-04-05; PartNumber: ZX62-B-5PA(11); PackageReference: Micro USB-B receptacle; CompType: Receptacle; RoHS: Y; MountType: SMT; ComponentLink1Description: Datasheet Link; ComponentLink1URL: http://www.hirose.co.jp/cataloge_hp/e24200011.pdf; Publisher: Texas Instruments; LatestRevisionDate: 2015-06-10; Supplier 1: Digi-Key; Supplier Part Number 1: H11634CT-ND; Supplier 2: Mouser; Supplier Part Number 2: 798-ZX62-B-5PA11; Supplier 3: Farnell; Supplier Part Number 3: 1645325
L1 = MMZ2012R300A_2: Ferrite Bead, 30 ohm @ 100 MHz, 1.5 A, 0805; Manufacturer: TDK; Imax_A: 1.5; DCR_ohm: 0.05; Value1: 0.05 ohm; Value2: 1.5A; ZTyp@100MHz_Ohm: 30; ComponentLink1URL: http://www.tdk.co.jp/tefe02/e9412_mmz.pdf; PackageReference: 0805; SymbolVersion: 2009-06-02; PartNumber: MMZ2012R300A; ComponentLink1Description: Datasheet link; Supplier 1: Digi-Key; Supplier Part Number 1: 445-2199-1-ND; MountType: SMT; CompType: Ferrite Bead; Published: 2014-04-30; Publisher: Texas Instruments; LatestRevisionDate: 2015-06-08; RoHS: Y; Supplier 2: Mouser; Supplier Part Number 2: 810-MMZ2012R300A; Supplier 3: Farnell; Supplier Part Number 3: 1669723
U4 = FT232RL: USB to Serial UART, SSOP28; Manufacturer: FTDI; SymbolCreator: x0208326; ComponentLink1URL: http://www.ftdichip.com/Support/Documents/DataSheets/ICs/DS_FT232R.pdf; PackageReference: SSOP28; PartNumber: FT232RL; SymbolVersion: 2014-03-03; ComponentLink1Description: Datasheet Link; Supplier 1: Digi-Key; Supplier Part Number 1: 768-1007-1-ND; MountType: SMT; RoHS: Y; Publisher: Texas Instruments; LatestRevisionDate: 2015-06-10; Supplier 2: Mouser; Supplier Part Number 2: 895-FT232RL; Supplier 3: Farnell; Supplier Part Number 3: 1146032

## Sheet stepper-schematic.SchDoc
size 381 x 241 mm; SheetNumber: 3; SheetTotal: 3
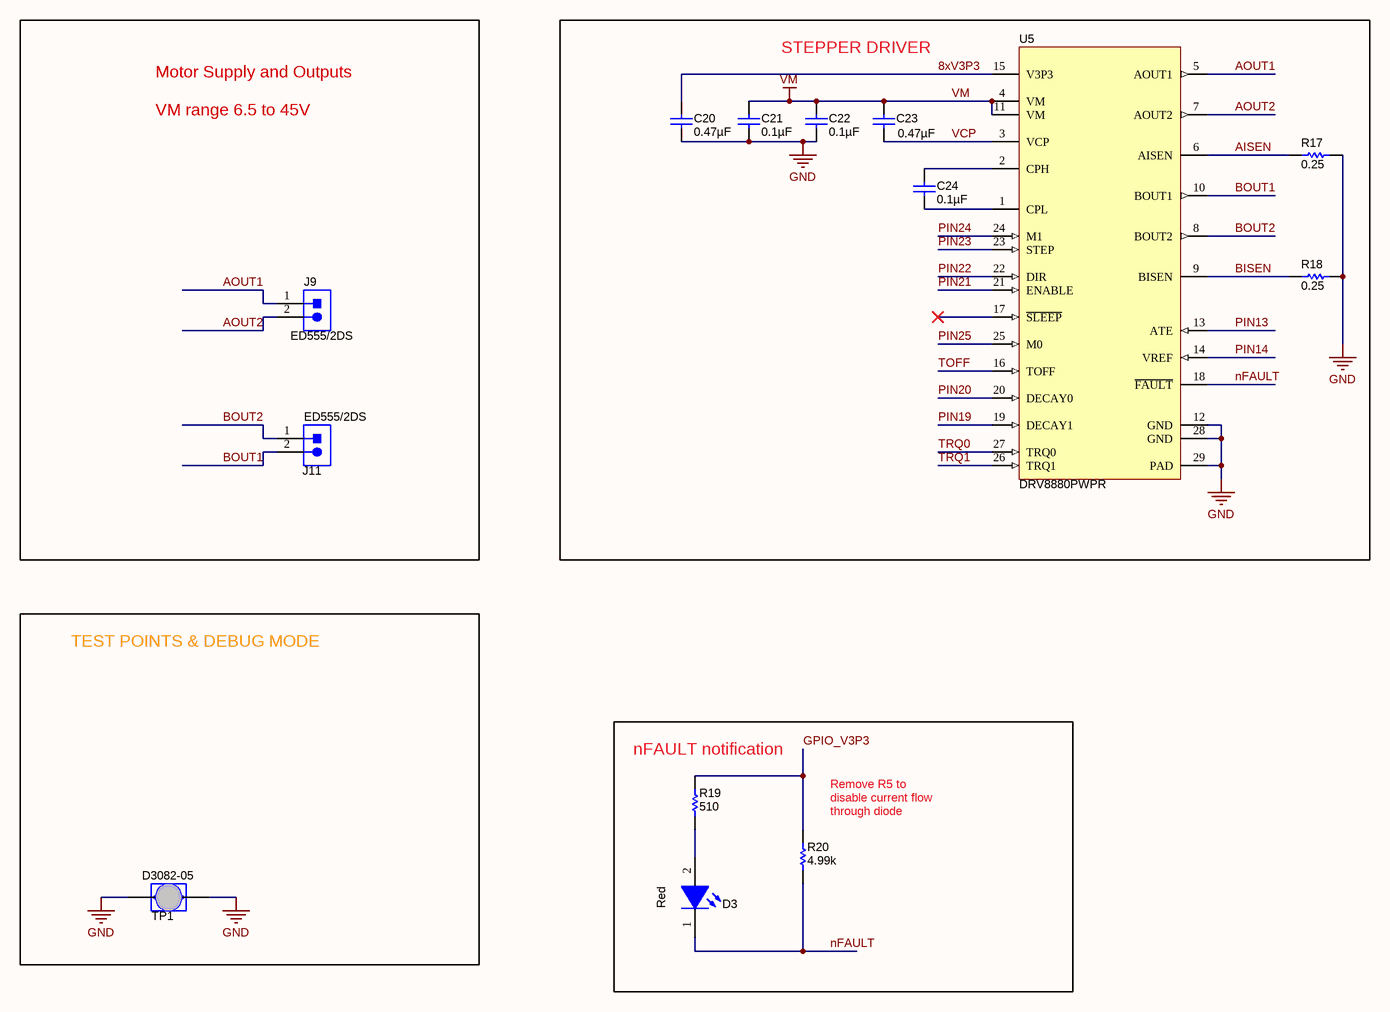
[diagram p2: stepper-schematic.SchDoc]

### Parts
C20  ValueDisplayed: 0.47µF  [0603L]  (hidden comment: C0603C474K9RACTU)
C21  ValueDisplayed: 0.1µF  [0805L]  (hidden comment: C0805C104K1RACTU)
C22  ValueDisplayed: 0.1µF  [0805L]  (hidden comment: C0805C104K1RACTU)
C23  ValueDisplayed: 0.47µF  [0805L]  (hidden comment: C2012X7R1E474K)
C24  ValueDisplayed: 0.1µF  [0805L]  (hidden comment: C0805C104K1RACTU)
D3  value Red  [WL-SMCW_RED]  (hidden comment: 150060RS75000)
J9  ED555/2DS  [TERM_BLK_ED555-2DS]
J11  ED555/2DS  [TERM_BLK_ED555-2DS]
R17  value 0.25  [2010L]  (hidden comment: CSRN2010FKR250)
R18  value 0.25  [2010L]  (hidden comment: CSRN2010FKR250)
R19  value 510  [0402L]  (hidden comment: CRCW0402510RJNED)
R20  value 4.99k  [0402L]  (hidden comment: CRCW04024K99FKED)
TP1  D3082-05  [Harwin_D3082-05]
U5  DRV8880PWPR  [PWP0028C_N]

### Blocks framed on the sheet
STEPPER DRIVER: C20-C24 R17 R18 U5
TEST POINTS & DEBUG MODE: TP1
nFAULT notification: D3 R19 R20

### Nets
GND: C20.2 C21.1 C22.1 R17.1 R18.1 TP1.1 TP1.2 U5.12(GND) U5.28(GND) U5.29(PAD)
VM: C21.2 C22.2 C23.2 U5.4(VM) U5.11(VM)
8xV3P3: C20.1 U5.15(V3P3)
AISEN: R17.2 U5.6(AISEN)
AOUT1: J9.1 U5.5(AOUT1)
AOUT2: J9.2 U5.7(AOUT2)
BISEN: R18.2 U5.9(BISEN)
BOUT1: J11.2 U5.10(BOUT1)
BOUT2: J11.1 U5.8(BOUT2)
GPIO_V3P3: R19.2 R20.2
nFAULT: D3.1(K) R20.1 U5.18(~{FAULT})
PIN13: U5.13(ATE)
PIN14: U5.14(VREF)
PIN19: U5.19(DECAY1)
PIN20: U5.20(DECAY0)
PIN21: U5.21(ENABLE)
PIN22: U5.22(DIR)
PIN23: U5.23(STEP)
PIN24: U5.24(M1)
PIN25: U5.25(M0)
TOFF: U5.16(TOFF)
TRQ0: U5.27(TRQ0)
TRQ1: U5.26(TRQ1)
VCP: C23.1 U5.3(VCP)
NetC24_1: C24.1 U5.1(CPL)
NetC24_2: C24.2 U5.2(CPH)
NetD3_2: D3.2(A) R19.1

Not connected (* = marked no-connect by the designer): U5 17(~{SLEEP})*

### Notes on the sheet
- Motor Supply and Outputs
  VM range 6.5 to 45V
- (near R20) Remove R5 to disable current flow through diode

### Library data of the parts
C20 = C0603C474K9RACTU: CAP, CERM, 0.47 µF, 6.3 V, +/- 10%, X7R, 0603; Manufacturer: Kemet; Polarized: N; CompType: Capacitor; Value: 0.47uF; U/M: EA; Cap_F: 0.00000047; Tolerance_%: 10; Value1: Unknown; VDC_V: 6.3; Value2: 6.3V; TaMin_C: -55; TaMax_C: 125; Cap_Case: 0603; SymbolVersion: 2008-07-09; PartNumber: C0603C474K9RACTU; PackageReference: 0603; RoHS: Y; MountType: SMT; Technology: Ceramic; TempCo: X7R; Published: 2008-06-19; Publisher: Texas Instruments; LatestRevisionDate: 2015-06-10; ComponentLink1Description: Datasheet link; ComponentLink1URL: http://www.kemet.com/kemet/web/homepage/kechome.nsf/vapubfiles/F3102_Y5V.pdf/$file/F3102_Y5V.pdf; Supplier 1: Digi-Key; Supplier Part Number 1: 399-4924-1-ND; Supplier 2: Mouser; Supplier Part Number 2: 80-C0603C474K9R
C21 C22 C24 = C0805C104K1RACTU: CAP, CERM, 0.1 µF, 100 V, +/- 10%, X7R, 0805; Manufacturer: Kemet; Polarized: N; CompType: Capacitor; Value: 0.1uF; U/M: EA; Cap_F: 0.0000001; Tolerance_%: 10; ESR_ohm: 0.064; Value1: 0.064 ohm; VDC_V: 100; Value2: 100V; IRMS_A: 1.64; TaMin_C: -55; TaMax_C: 125; Cap_Case: 0805; SymbolVersion: 2008-07-09; PartNumber: C0805C104K1RACTU; PackageReference: 0805; RoHS: Y; MountType: SMT; Technology: Ceramic; TempCo: X7R; Published: 2008-06-19; Publisher: Texas Instruments; LatestRevisionDate: 2015-06-10; ComponentLink1Description: Datasheet link; ComponentLink1URL: http://www.kemet.com/kemet/web/homepage/kechome.nsf/file/Partial%20Copy%20-%20Ceramic%20Surface%20Mount%20Capacitors/$file/F3102_CE.pdf; Supplier 1: Digi-Key; Supplier Part Number 1: 399-3486-1-ND; Supplier 2: Mouser; Supplier Part Number 2: 80-C0805C104K1R; Supplier 3: Farnell; Supplier Part Number 3: 1650862
C23 = C2012X7R1E474K: CAP, CERM, 0.47 µF, 25 V, +/- 10%, X7R, 0805; Manufacturer: TDK; Polarized: N; CompType: Capacitor; Value: 0.47uF; U/M: EA; Cap_F: 0.00000047; Tolerance_%: 10; ESR_ohm: 0.0101; Value1: 0.0101 ohm; VDC_V: 25; Value2: 25V; TaMin_C: -55; TaMax_C: 125; Cap_Case: 0805; SymbolVersion: 2008-07-09; PartNumber: C2012X7R1E474K; PackageReference: 0805; RoHS: Y; MountType: SMT; Technology: Ceramic; TempCo: X7R; Published: 2008-06-19; Publisher: Texas Instruments; LatestRevisionDate: 2015-06-10; ComponentLink1Description: Datasheet link; ComponentLink1URL: http://www.tdk.co.jp/tefe02/e412_c.pdf; Supplier 1: Digi-Key; Supplier Part Number 1: 445-1353-1-ND; Supplier 2: Farnell; Supplier Part Number 2: 1844282
D3 = CMP-0002947-2: as D1 on sheet DRVS-SCHEMA; CompType: LED; PartNumber: 150060RS75000; MountType: SMT; RoHS: Y; PackageReference: LED_0603; Value2: 2V; Color: Red; Published: 2008-07-11; Publisher: Texas Instruments; ComponentLink1URL: http://katalog.we-online.de/led/datasheet/150060RS75000.pdf; ComponentLink1Description: Datasheet link; LatestRevisionDate: 2017-03-09; Supplier 1: Digi-Key; Supplier Part Number 1: 732-4978-1-ND; Supplier 2: Newark; Supplier Part Number 2: 95W3795; Supplier 3: Mouser; Supplier Part Number 3: 710-150060RS75000
J9 J11 = ED555/2DS: Terminal Block, 6A, 3.5mm Pitch, 2-Pos, TH; Manufacturer: On-Shore Technology; SymbolCreator: a0412235; CompType: Connector; U/M: EA; ComponentLink1URL: http://on-shore.com/sites/default/files/manuals/ed555ds.pdf; SymbolVersion: 2013-10-31; PackageReference: 7.0x8.2x6.5mm; PartNumber: ED555/2DS; ComponentLink1Description: Datasheet Link; RoHS: Y; MountType: TH; Publisher: Texas Instruments; LatestRevisionDate: 2015-06-10; Supplier 1: Digi-Key; Supplier Part Number 1: ED1514-ND
R17 R18 = CSRN2010FKR250: RES, 0.25, 1%, 1 W, 2010; Manufacturer: Stackpole Electronics Inc; CompType: Resistor; Value_Code: R250; Tolerance_%: 1; Value2: 1W; TempCo: 250 ppm/C; U/M: EA; SymbolVersion: 2009-05-29; PartNumber: CSRN2010FKR250; PackageReference: 2010; RoHS: Y; Res_ohm: 0.25; Value1: 1%; Power_W: 1; MountType: SMT; Technology: Thick Film; Published: 2008-06-26; Publisher: Texas Instruments; LatestRevisionDate: 2015-04-13; ComponentLink1Description: Datasheet link; ComponentLink1URL: http://www.seielect.com/Catalog/SEI-csr.pdf; Supplier 1: Digi-Key; Supplier Part Number 1: CSRN2010FKR250CT-ND; ValueDisplayed: 0.25
R19 = CRCW0402510RJNED: RES, 510, 5%, 0.063 W, 0402; Manufacturer: Vishay-Dale; CompType: Resistor; Value_Code: 510R; Tolerance_%: 5; Power_W: 0.063; Value2: 0.063W; VDC_V: 50; TempCo: 200 ppm/C; EIA_Code: E24; U/M: EA; SymbolVersion: 2009-05-29; PartNumber: CRCW0402510RJNED; PackageReference: 0402; RoHS: Y; Res_ohm: 510; Value1: 5%; MountType: SMT; Technology: Thick Film; Published: 2008-06-26; Publisher: Texas Instruments; LatestRevisionDate: 2015-05-27; ComponentLink1Description: Datasheet link; ComponentLink1URL: http://www.vishay.com/docs/20035/dcrcwe3.pdf; Supplier 1: Digi-Key; Supplier Part Number 1: 541-510JCT-ND; Supplier 2: Mouser; Supplier Part Number 2: 71-CRCW0402J-510-E3; Supplier 3: Farnell; Supplier Part Number 3: 1570682; ValueDisplayed: 510
R20 = CRCW04024K99FKED: RES, 4.99 k, 1%, 0.063 W, 0402; Manufacturer: Vishay-Dale; CompType: Resistor; Res_ohm: 4990; Value_Code: 4k99; Tolerance_%: 1; Power_W: 0.063; Value2: 0.063W; VDC_V: 50; TempCo: 100 ppm/C; EIA_Code: E96; U/M: EA; SymbolVersion: 2009-05-29; PartNumber: CRCW04024K99FKED; PackageReference: 0402; RoHS: Y; Value1: 1%; MountType: SMT; Technology: Thick Film; Published: 2008-06-26; Publisher: Texas Instruments; LatestRevisionDate: 2015-05-27; ComponentLink1Description: Datasheet link; ComponentLink1URL: http://www.vishay.com/docs/20035/dcrcwe3.pdf; Supplier 1: Digi-Key; Supplier Part Number 1: 541-4.99KLCT-ND; Supplier 2: Mouser; Supplier Part Number 2: 71-CRCW0402-4.99K-E3; Supplier 3: Farnell; Supplier Part Number 3: 1469715; ValueDisplayed: 4.99k
TP1 = D3082-05: 1mm Uninsulated Shorting Plug, 10.16mm spacing, TH; Manufacturer: Harwin; SymbolCreator: a0799628; CompType: Jumper Wire; U/M: EA; SymbolVersion: 2014-05-16; MountType: TH; RoHS: Y; PartNumber: D3082-05; PackageReference: Shorting Plug, 10.16mm spacing, TH; ComponentLink1Description: Datasheet Link; ComponentLink1URL: http://cdn.harwin.com/pdfs/D3080-D3083.pdf; Supplier 1: Digi-Key; Supplier 2: Mouser; Supplier Part Number 1: 952-1873-ND; Supplier Part Number 2: 855-D3082-05; Publisher: Texas Instruments; LatestRevisionDate: 2015-06-10
U5 = DRV8880PWPR: 2-A 45-V 1/16-μstep Stepper Motor Driver With AutoTune, PWP0028C; Manufacturer: Texas Instruments; SymbolCreator: Altium; CompType: IC; U/M: EA; SymbolVersion: 2015-05-04; PartNumber: DRV8880PWPR; Alternate PartNumber: DRV8880PWP; PackageReference: PWP0028C; MountType: SMT; ComponentLink1Description: Datasheet Link; ComponentLink1URL: https://sps06.itg.ti.com/sites/KMS/crossdivteams/altium/docs/ComponentDatasheets/SLVSD18_060515.pdf; Publisher: Texas Instruments; LatestRevisionDate: 2015-06-11; Alternate Manufacturer: Texas Instruments

## Nets that join several sheets
GND: DRVS-SCHEMA (46 pins), usb sheet (16 pins), stepper-schematic (10 pins)
VCC: DRVS-SCHEMA (21 pins), usb sheet (C16.1 C17.1 U4.4 U4.17)
VM: DRVS-SCHEMA (6 pins), stepper-schematic (5 pins)
PIN13: DRVS-SCHEMA (U2.15), stepper-schematic (U5.13)
PIN14: DRVS-SCHEMA (U2.16), stepper-schematic (U5.14)
PIN19: DRVS-SCHEMA (U2.39), stepper-schematic (U5.19)
PIN20: DRVS-SCHEMA (U2.38), stepper-schematic (U5.20)
PIN21: DRVS-SCHEMA (U2.31), stepper-schematic (U5.21)
PIN22: DRVS-SCHEMA (U2.30), stepper-schematic (U5.22)
PIN23: DRVS-SCHEMA (U2.29), stepper-schematic (U5.23)
PIN24: DRVS-SCHEMA (U2.28), stepper-schematic (U5.24)
PIN25: DRVS-SCHEMA (U2.27), stepper-schematic (U5.25)
RX: DRVS-SCHEMA (U2.17), usb sheet (U4.5)
TOFF: DRVS-SCHEMA (U2.40), stepper-schematic (U5.16)
TRQ0: DRVS-SCHEMA (U2.26), stepper-schematic (U5.27)
TRQ1: DRVS-SCHEMA (U2.25), stepper-schematic (U5.26)
TX: DRVS-SCHEMA (U2.18), usb sheet (U4.1)